# Altium schematic sheet Display.SchDoc
size A4; SheetNumber: 4; SheetTotal: 4
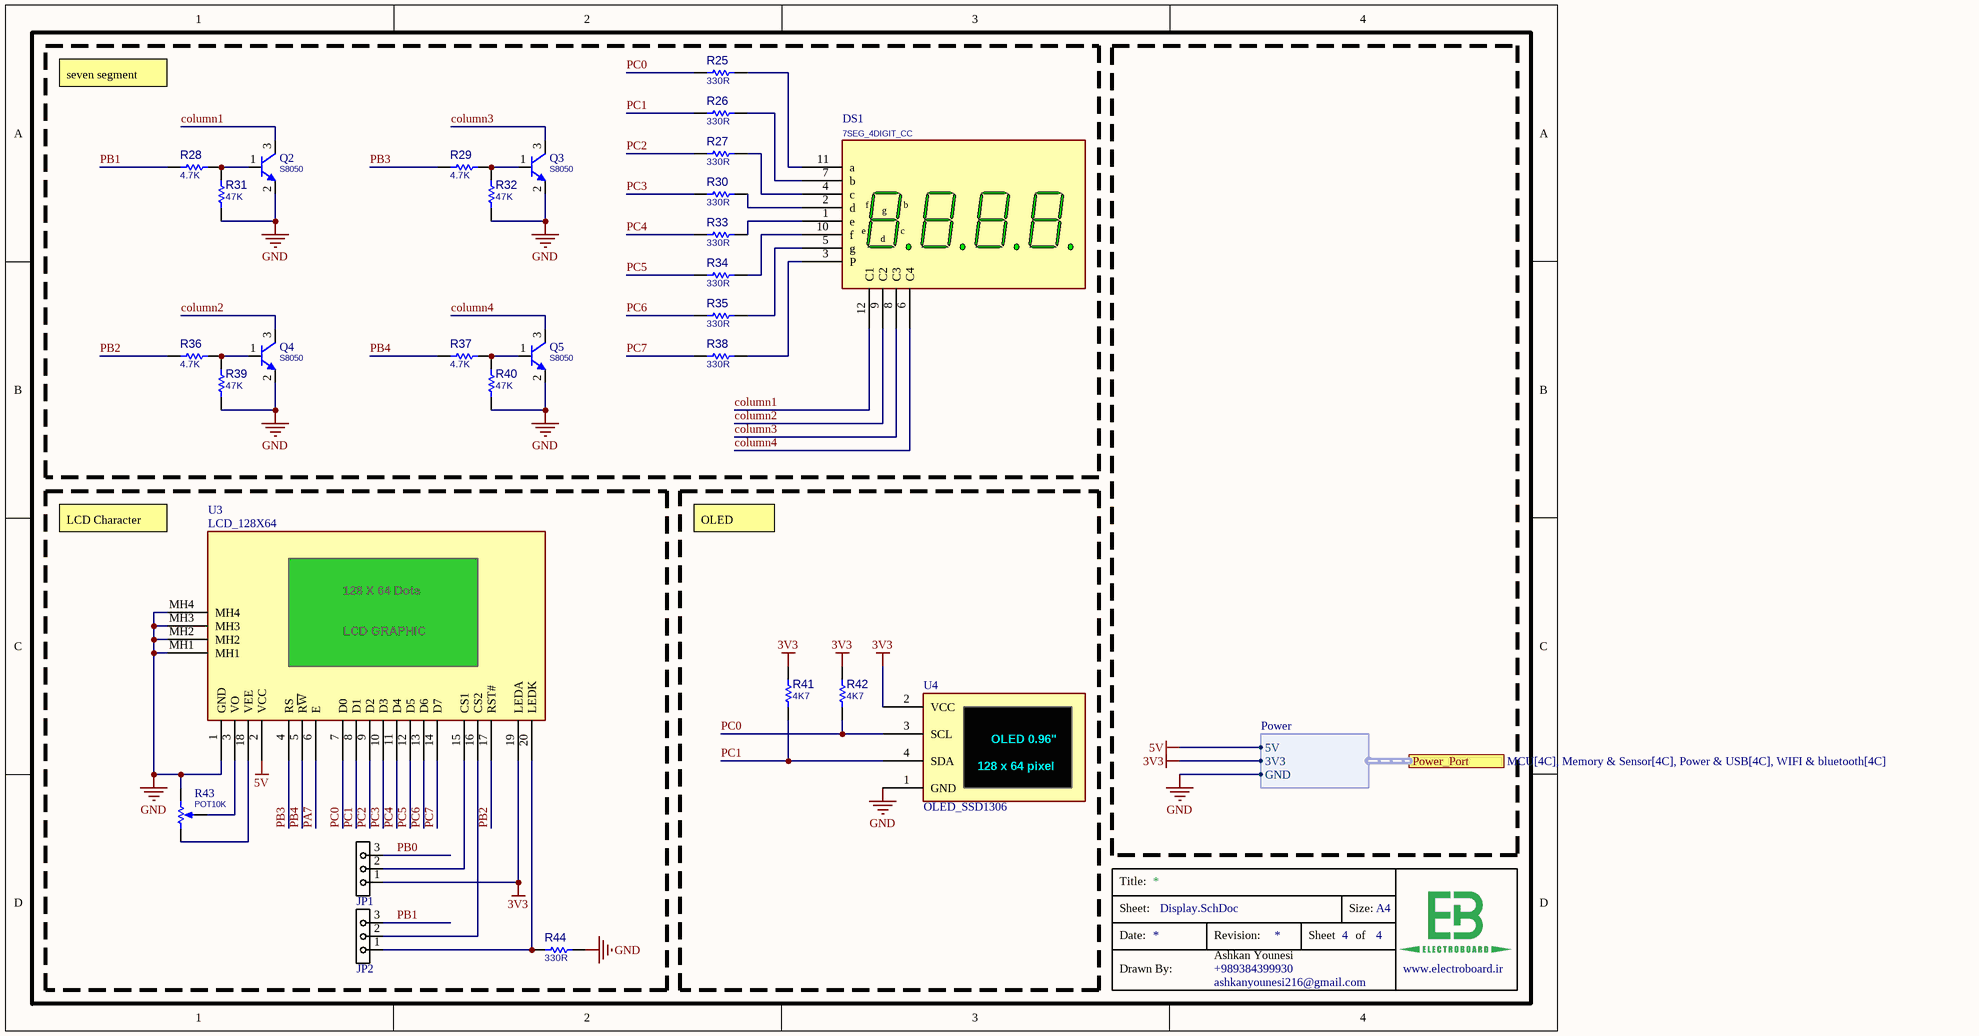
[diagram p0: Display.SchDoc]

## Parts
DS1  7SEG_4DIGIT_CC  [7SEGX4_12]
JP1  JMPHDR3PIN  [JP_3]  (value not drawn)
JP2  JMPHDR3PIN  [JP_3]  (value not drawn)
Q2  S8050  [SOT23_3]
Q3  S8050  [SOT23_3]
Q4  S8050  [SOT23_3]
Q5  S8050  [SOT23_3]
R25  330R  [R0805]
R26  330R  [R0805]
R27  330R  [R0805]
R28  4.7K  [R0805]
R29  4.7K  [R0805]
R30  330R  [R0805]
R31  47K  [R0805]
R32  47K  [R0805]
R33  330R  [R0805]
R34  330R  [R0805]
R35  330R  [R0805]
R36  4.7K  [R0805]
R37  4.7K  [R0805]
R38  330R  [R0805]
R39  47K  [R0805]
R40  47K  [R0805]
R41  4K7  [R0805]
R42  4K7  [R0805]
R43  POT10K  [POT_3296W]
R44  330R  [R0805]
U3  LCD_128X64  [LCDG_128X64_GRN]
U4  OLED_SSD1306  [OLED_SSD1306_64_I2C]

## Ports
Power_Port (harness POWER, see MCU[4C], Memory & Sensor[4C], Power & USB[4C], WIFI & bluetooth[4C])

## Harnesses
Power: 5V, 3V3, GND

## Nets
3V3: JP1.1 R41.1 R42.1 U3.19(LEDA) U4.2(VCC) ; port Power_Port.3V3
5V: U3.2(VCC) ; port Power_Port.5V
GND: Q2.2(E) Q3.2(E) Q4.2(E) Q5.2(E) R31.1 R32.1 R39.1 R40.1 R43.3(BOT) R44.1 U3.1(GND) U3.MH1 U3.MH2 U3.MH3 U3.MH4 U4.1(GND) ; port Power_Port.GND
column1: DS1.12(C1) Q2.3(C)
column2: DS1.9(C2) Q4.3(C)
column3: DS1.8(C3) Q3.3(C)
column4: DS1.6(C4) Q5.3(C)
PA7: U3.6(E)
PB0: JP1.3
PB1: JP2.3 R28.1
PB2: R36.1 U3.17(RST#)
PB3: R29.1 U3.4(RS)
PB4: R37.1 U3.5(R~{W})
PC0: R25.1 R42.2 U3.7(D0) U4.3(SCL)
PC1: R26.1 R41.2 U3.8(D1) U4.4(SDA)
PC2: R27.1 U3.9(D2)
PC3: R30.1 U3.10(D3)
PC4: R33.1 U3.11(D4)
PC5: R34.1 U3.12(D5)
PC6: R35.1 U3.13(D6)
PC7: R38.1 U3.14(D7)
NetDS1_1: DS1.1(e) R33.2
NetDS1_2: DS1.2(d) R30.2
NetDS1_3: DS1.3(P) R38.2
NetDS1_4: DS1.4(c) R27.2
NetDS1_5: DS1.5(g) R35.2
NetDS1_7: DS1.7(b) R26.2
NetDS1_10: DS1.10(f) R34.2
NetDS1_11: DS1.11(a) R25.2
NetJP1_2: JP1.2 U3.15(CS1)
NetJP2_1: JP2.1 R44.2 U3.20(LEDK)
NetJP2_2: JP2.2 U3.16(CS2)
NetQ2_1: Q2.1(B) R28.2 R31.2
NetQ3_1: Q3.1(B) R29.2 R32.2
NetQ4_1: Q4.1(B) R36.2 R39.2
NetQ5_1: Q5.1(B) R37.2 R40.2
NetR43_1: R43.1(TOP) U3.18(VEE)
NetR43_2: R43.2(TAP) U3.3(VO)

## Notes on the sheet
- seven segment
- LCD Character
- OLED
- Title:
- Sheet:
- Size:
- A4
- Drawn By:
- Date:
- Revision:
- Ashkan Younesi
- ashkanyounesi216@gmail.com
- +989384399930
- Sheet
- of
- www.electroboard.ir <http://www.electroboard.ir>
- (in symbol LCDG_128X64_GRN) 128 X 64 Dots; LCD GRAPHIC
- (in symbol OLED_SSD1306_64_I2C) OLED 0.96"; 128 x 64 pixel

## Library data of the parts
DS1 = 7SEG_4DIGIT_CC: 7SEGMENT, 4DIGIT, common cathode 5641; MANF_P#: DPY-4CK; VALUE: 7SEG_4DIGIT_CC
JP1 JP2 = JUMPER_HDR_3P: JUMPER, HEADER 3PIN; MANF: MANF; MANF_P#: MANF_P#; VALUE: JMPHDR3PIN
Q2-Q5 = NPN_S8050_SOT23: BJT, NPN, 25v, 0.5A, SMD, SOT23; PARAM2: 300mW; PARAM: 25v, 0.5A; MANF_P#: S8050; MANF: -; VALUE: S8050
R25-R42 R44 = RES_SMD_0805: RESISTOR, SMD; PARAM: -W; DESC: DESCRIPTION; DIST#: MOUSER; PARAM2: 1%; MANF_P#: -; MANF: -; ASSEMBLY: ASSEMBLY; PRICE: 100= 0.5$
  R25-R27 R30 R33-R35 R38 R44: VALUE: 330R
  R28 R29 R36 R37: VALUE: 4.7K
  R31 R32 R39 R40: VALUE: 47K
  R41 R42: VALUE: 4K7
R43 = RES_THD_POT_MULTITURN: RESISTOR, THD, Potentiometer Multiturn, most Popular; VALUE: POT10K
U3 = LCDG_128X64_GRN: LCD Graphic Disp, 128X64, with KS108 Controller; MANF: Winstar; MANF_P#: TS12864A-2, WG12864A-1; PARAM2: Green back, Gray, 5V; PARAM: 128X64 Dots, 2.9"; VALUE: LCD_128X64
U4 = OLED_SSD1306_64_I2C: OLED, SSD1306, 0.96", 128X64, BREAKOUT I2C; MANF_P#: OLED_SSD1306_I2C; PARAM2: 3.3/5VCC, -20~70oC; PARAM: 2 Colors, 0.96", 128X64; MANF: -; VALUE: OLED_SSD1306